# EAGLE design STorM32 Micro MotorTripple v02 micro (EAGLE 7.5.0)
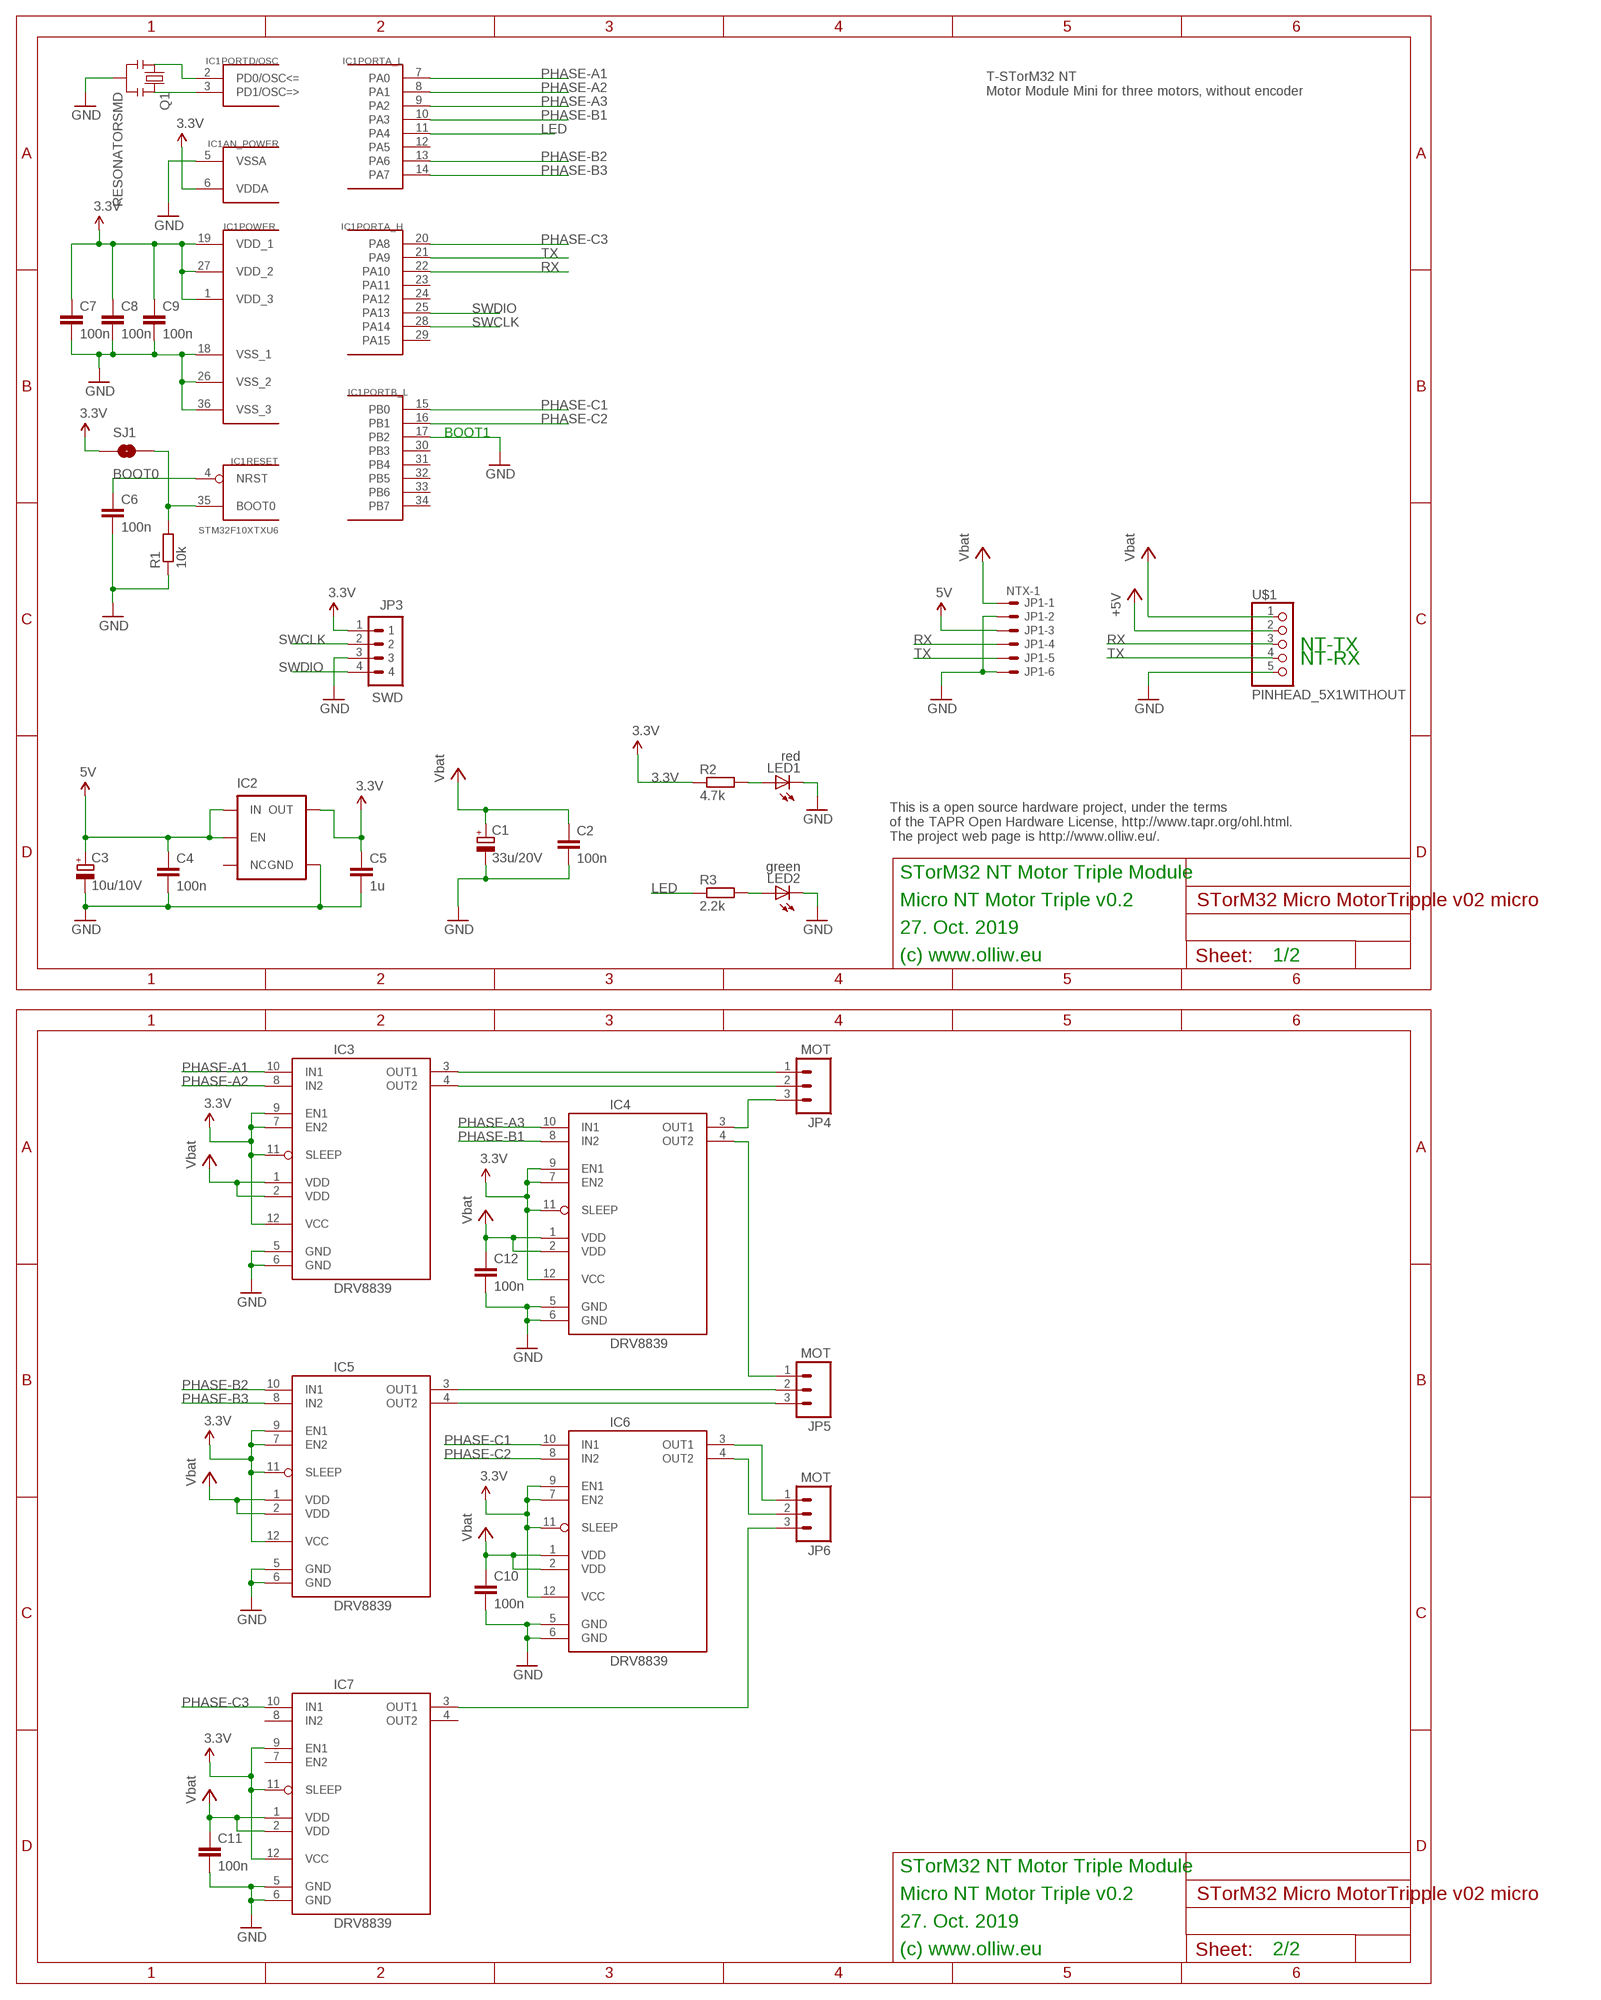
[diagram p0: schematic, sheet 1]

## Parts
C1  33u/20V  CPOL-EUSMCB  [SMC_B]
C2  100n  C-EUC0603  [C0603]
C3  10u/10V  CPOL-EUSMCA  [SMC_A]
C4  100n  C-EUC0402  [C0402]
C5  1u  C-EUC0603  [C0603]
C6  100n  C-EUC0402  [C0402]
C7  100n  C-EUC0402  [C0402]
C8  100n  C-EUC0402  [C0402]
C9  100n  C-EUC0402  [C0402]
C10  100n  C-EUC0603  [C0603]
C11  100n  C-EUC0603  [C0603]
C12  100n  C-EUC0603  [C0603]
IC1  STM32F10XTXU6  [VFQFPN36]
IC2  V_REG_TPS76433SOT23-5  [SOT23-5]
IC3  DRV8839  [WSON-12-2X3MM]
IC4  DRV8839  [WSON-12-2X3MM]
IC5  DRV8839  [WSON-12-2X3MM]
IC6  DRV8839  [WSON-12-2X3MM]
IC7  DRV8839  [WSON-12-2X3MM]
JP1  NTX-1  SM06B-SRSS-TB  [SM06B-SRSS-TB]
JP3  SWD  P4X1_1P27-OCT_BILEX  [4X1_1P27_OCT_BILEX]
JP4  MOT  M03PTH  [1X03]
JP5  MOT  M03PTH  [1X03]
JP6  MOT  M03PTH  [1X03]
LED1  red  LEDCHIPLED_0603  [CHIPLED_0603]
LED2  green  LEDCHIPLED_0603  [CHIPLED_0603]
Q1  RESONATORSMD  [RESONATOR-SMD]
R1  10k  R-EU_R0402  [R0402]
R2  4.7k  R-EU_R0402  [R0402]
R3  2.2k  R-EU_R0402  [R0402]
SJ1  BOOT0  SOLDERJUMPERNO  [SJ_2S-NO]
U$1  PINHEAD_5X1WITHOUT  [PINHEAD_5X1_WO]

## Nets
3.3V: C5.1 C7.1 C8.1 C9.1 IC1.1(POWER:VDD_3) IC1.6(AN_POWER:VDDA) IC1.19(POWER:VDD_1) IC1.27(POWER:VDD_2) IC2.5(OUT) IC3.7(EN2) IC3.9(EN1) IC3.11(SLEEP) IC3.12(VCC) IC4.7(EN2) IC4.9(EN1) IC4.11(SLEEP) IC4.12(VCC) IC5.7(EN2) IC5.9(EN1) IC5.11(SLEEP) IC5.12(VCC) IC6.7(EN2) IC6.9(EN1) IC6.11(SLEEP) IC6.12(VCC) IC7.9(EN1) IC7.11(SLEEP) IC7.12(VCC) JP3.1 R2.1 SJ1.1
5V: C3.+ C4.1 IC2.1(IN) IC2.3(EN) JP1.3 U$1.2 ; supply symbol labelled +5V
GND: C1.- C2.2 C3.- C4.2 C5.2 C6.2 C7.2 C8.2 C9.2 C10.2 C11.2 C12.2 IC1.5(AN_POWER:VSSA) IC1.17(PORTB_L:PB2) IC1.18(POWER:VSS_1) IC1.26(POWER:VSS_2) IC1.36(POWER:VSS_3) IC2.2(GND) IC3.5(GND) IC3.6(GND) IC4.5(GND) IC4.6(GND) IC5.5(GND) IC5.6(GND) IC6.5(GND) IC6.6(GND) IC7.5(GND) IC7.6(GND) JP1.2 JP1.6 JP3.3 LED1.C LED2.C Q1.2 R1.1 U$1.5
LED: IC1.11(PORTA_L:PA4) R3.1
N$6: IC4.3(OUT1) JP4.3
N$7: C6.1 IC1.4(RESET:NRST)
N$8: IC1.35(RESET:BOOT0) R1.2 SJ1.2
N$9: IC1.2(PORTD/OSC:PD0/OSC<=) Q1.1
N$10: IC1.3(PORTD/OSC:PD1/OSC=>) Q1.3
N$11: LED1.A R2.2
N$12: LED2.A R3.2
N$13: IC6.3(OUT1) JP6.1
N$14: IC3.4(OUT2) JP4.2
N$15: IC3.3(OUT1) JP4.1
N$17: IC5.3(OUT1) JP5.2
N$18: IC4.4(OUT2) JP5.1
N$19: IC5.4(OUT2) JP5.3
N$20: IC6.4(OUT2) JP6.2
N$21: IC7.3(OUT1) JP6.3
PHASE-A1: IC1.7(PORTA_L:PA0) IC3.10(IN1)
PHASE-A2: IC1.8(PORTA_L:PA1) IC3.8(IN2)
PHASE-A3: IC1.9(PORTA_L:PA2) IC4.10(IN1)
PHASE-B1: IC1.10(PORTA_L:PA3) IC4.8(IN2)
PHASE-B2: IC1.13(PORTA_L:PA6) IC5.10(IN1)
PHASE-B3: IC1.14(PORTA_L:PA7) IC5.8(IN2)
PHASE-C1: IC1.15(PORTB_L:PB0) IC6.10(IN1)
PHASE-C2: IC1.16(PORTB_L:PB1) IC6.8(IN2)
PHASE-C3: IC1.20(PORTA_H:PA8) IC7.10(IN1)
RX: IC1.22(PORTA_H:PA10) JP1.4 U$1.3
SWCLK: IC1.28(PORTA_H:PA14) JP3.2
SWDIO: IC1.25(PORTA_H:PA13) JP3.4
TX: IC1.21(PORTA_H:PA9) JP1.5 U$1.4
VCCG: C1.+ C2.1 C10.1 C11.1 C12.1 IC3.1(VDD) IC3.2(VDD) IC4.1(VDD) IC4.2(VDD) IC5.1(VDD) IC5.2(VDD) IC6.1(VDD) IC6.2(VDD) IC7.1(VDD) IC7.2(VDD) JP1.1 U$1.1 ; supply symbol labelled Vbat
Unconnected: IC1.12(PORTA_L:PA5) IC1.23(PORTA_H:PA11) IC1.24(PORTA_H:PA12) IC1.29(PORTA_H:PA15) IC1.30(PORTB_L:PB3) IC1.31(PORTB_L:PB4) IC1.32(PORTB_L:PB5) IC1.33(PORTB_L:PB6) IC1.34(PORTB_L:PB7) IC2.4(NC) IC7.4(OUT2) IC7.7(EN2) IC7.8(IN2)

## Notes on the sheet
- T-STorM32 NT
  Motor Module Mini for three motors, without encoder
- BOOT1
- NT-TX
- NT-RX
- This is a open source hardware project, under the terms
  of the TAPR Open Hardware License, http://www.tapr.org/ohl.html.
  The project web page is http://www.olliw.eu/.
- STorM32 NT Motor Triple Module
- Micro NT Motor Triple v0.2
- 27. Oct. 2019
- (c) www.olliw.eu | 1/2
- STorM32 NT Motor Triple Module
- Micro NT Motor Triple v0.2
- 27. Oct. 2019
- (c) www.olliw.eu | 2/2

## Library data of the parts
C1 C3 = rcl:CPOL-EU: POLARIZED CAPACITOR, European symbol
C2 C4-C12 = rcl:C-EU: CAPACITOR, European symbol
IC1 = # stm32:STM32F10XTXU6: STM32F101/103 36pad VFQPFN36
IC2 = # SparkFun2:V_REG_TPS76433: Voltage Regulator Older TI part. LDO 150mA regulator. No output by-pass cap option. See V_REG_LDO for a better part.
IC3-IC7 = # stdlib:DRV8839
JP1 = con-jst2:?M06B-SRSS-TB: Disconnectable Crimp style connector, 1.0mm pitch 6 contacts
JP3 = # stdlib:P4X1_1P27
JP4-JP6 = # SparkFun:M03: Header 3 Standard 3-pin 0.1" header. Use with straight break away headers (SKU : PRT-00116), right angle break away headers (PRT-00553), swiss pins (PRT-00743), machine pins (PRT-00117), and female headers (PRT-00115). Molex polarized connector foot print use with SKU : PRT-08232 with associated crimp pins and housings.
LED1 LED2 = led:LED: LED OSRAM: - CHIPLED LG R971, LG N971, LY N971, LG Q971, LY Q971, LO R971, LY R971 LH N974, LH R974 LS Q976, LO Q976, LY Q976 LO Q996 - Hyper CHIPLED LW Q18S LB Q993, LB Q99A, LB R99A - SideLED LS A670, LO A670, LY A670, LG A670, LP A670 LB A673, LV A673, LT A673, LW A673 LH A674 LY A675 LS A676, LA A676, LO A676, LY A676, LW A676 LS A679, LY A679, LG A679 - Hyper Micro SIDELED® LS Y876, LA Y876, LO Y876, LY Y876 LT Y87S - SmartLED LW L88C, LW L88S LB L89C, LB L89S, LG L890 LS L89K, LO L89K, LY L89K LS L896, LA L896, LO L896, LY L896 - TOPLED LS T670, LO T670, LY T670, LG T670, LP T670 LSG T670, LSP T670, LSY T670, LOP T670, LYG T670 LG T671, LOG T671, LSG T671 LB T673, LV T673, LT T673, LW T673 LH T674 LS T676, LA T676, LO T676, LY T676, LB T676, LH T676, LSB T676, LW T676 LB T67C, LV T67C, LT T67C, LS T67K, LO T67K, LY T67K, LW E67C LS E67B, LA E67B, LO E67B, LY E67B, LB E67C, LV E67C, LT E67C LW T67C LS T679, LY T679, LG T679 LS T770, LO T770, LY T770, LG T770, LP T770 LB T773, LV T773, LT T773, LW T773 LH T774 LS E675, LA E675, LY E675, LS T675 LS T776, LA T776, LO T776, LY T776, LB T776 LHGB T686 LT T68C, LB T68C - Hyper Mini TOPLED® LB M676 - Mini TOPLED Santana® LG M470 LS M47K, LO M47K, LY M47K Source: http://www.osram.convergy.de LUXEON: - LUMILED® LXK2-PW12-R00, LXK2-PW12-S00, LXK2-PW14-U00, LXK2-PW14-V00 LXK2-PM12-R00, LXK2-PM12-S00, LXK2-PM14-U00 LXK2-PE12-Q00, LXK2-PE12-R00, LXK2-PE12-S00, LXK2-PE14-T00, LXK2-PE14-U00 LXK2-PB12-K00, LXK2-PB12-L00, LXK2-PB12-M00, LXK2-PB14-N00, LXK2-PB14-P00, LXK2-PB14-Q00 LXK2-PR12-L00, LXK2-PR12-M00, LXK2-PR14-Q00, LXK2-PR14-R00 LXK2-PD12-Q00, LXK2-PD12-R00, LXK2-PD12-S00 LXK2-PH12-R00, LXK2-PH12-S00 LXK2-PL12-P00, LXK2-PL12-Q00, LXK2-PL12-R00 Source: www.luxeon.com KINGBRIGHT: KA-3528ASYC Source: www.kingbright.com
Q1 = # SparkFun2:RESONATOR: Resonator Small SMD resonator. This is the itty bitty 10/20MHz resonators with built in caps. CSTCE10M0G55 and CSTCE20M0V53. Footprint has been reviewed closely but hasn't been tested yet.
R1-R3 = rcl:R-EU_: RESISTOR, European symbol
SJ1 = # SparkFun2:SOLDERJUMPER: Solder Jumper Standard SMD solder jumper. Used to automate production. Two varients : Normally Open and Normally Closed are the same, but have different paste layers. NC will have a large amount of paste and should jumper during reflow.
U$1 = # stdlib:PINHEAD_5X1

## Board
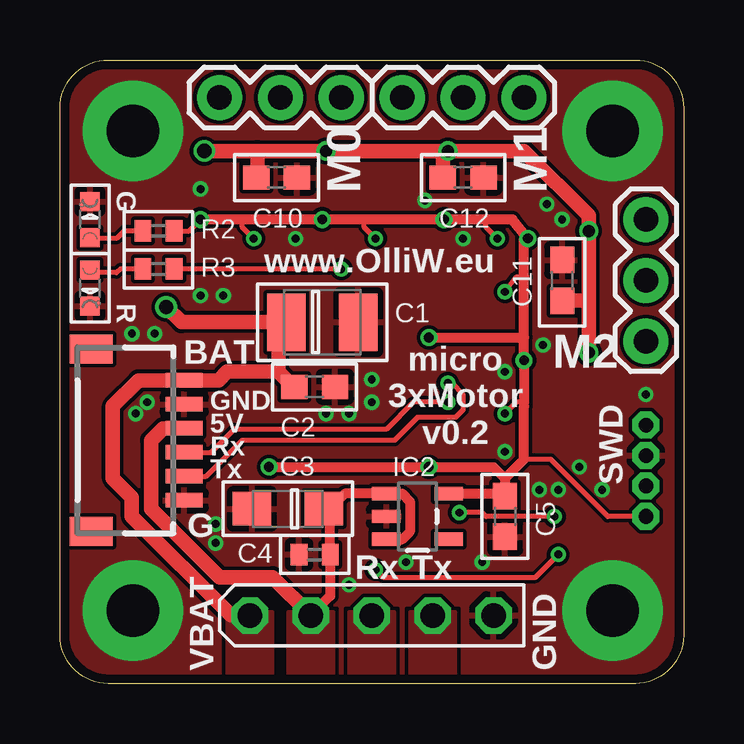
[diagram p1: board, top side]
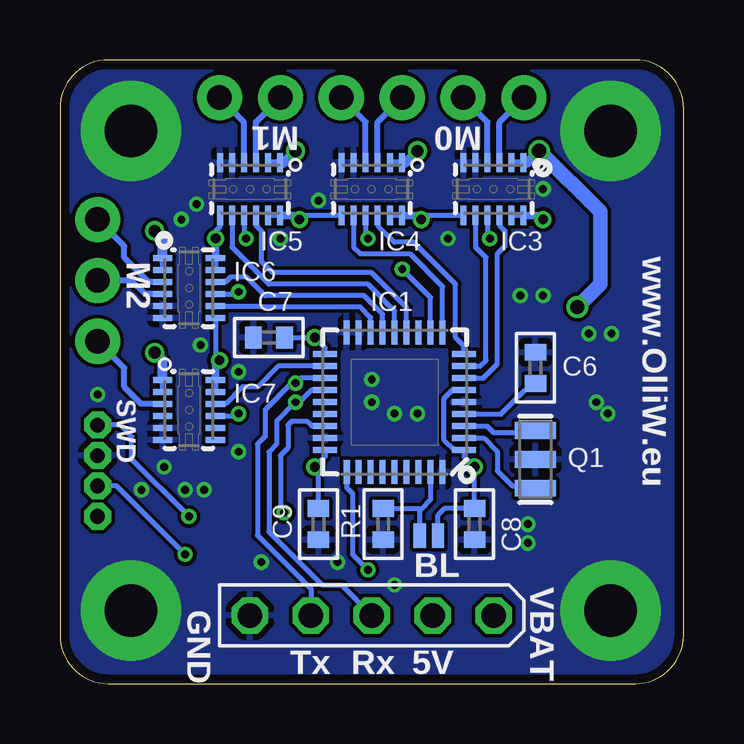
[diagram p2: board, bottom side, seen from below]

Size 26 x 26 mm. Coordinates in mm from the lower left corner, seen from the top.
Outline: 24,0 2,0 arc-90 0,2 0,24 arc-90 2,26 24,26 arc-90 26,24 26,2 arc-90 24,0
Copper layers (1*16): Top 0.035mm / dielectric 1.5mm / Bottom 0.035mm
Design rules "ShenZhen2U_2layer_EagleRules *": minimum track width 6mil, minimum drill 12mil, track to track 6mil, track to pad 6mil, pad to pad 6mil, via to via 6mil, smd to smd 0mil, copper to edge 15mil, drill to drill 10mil, minimum pad ring 10mil, minimum via ring 6mil, stop-mask expansion 2mil, vias tented up to drill 25mil, thermal gap 10mil

### Footprints (pad centres in the part's own frame; a part is rotated, then mirrored left to right if it is on the bottom)
SMC_B = smd 1.6 x 2.4: + -1.5,0; - 1.5,0
C0603 = smd 1.1 x 1: 1 -0.85,0; 2 0.85,0
SMC_A = smd 1.6 x 1.4: + -1.5,0; - 1.5,0
C0402 = smd 0.7 x 0.9: 1 -0.65,0; 2 0.65,0
VFQFPN36 = smd 1 x 0.25: 1 -2.9,2; 2 -2.9,1.5; 3 -2.9,1; 4 -2.9,0.5; 5 -2.9,0; 6 -2.9,-0.5; 7 -2.9,-1; 8 -2.9,-1.5; 9 -2.9,-2; 19 2.9,-2; 20 2.9,-1.5; 21 2.9,-1; 22 2.9,-0.5; 23 2.9,0; 24 2.9,0.5; 25 2.9,1; 26 2.9,1.5; 27 2.9,2 | smd 0.25 x 1: 10 -2,-2.9; 11 -1.5,-2.9; 12 -1,-2.9; 13 -0.5,-2.9; 14 0,-2.9; 15 0.5,-2.9; 16 1,-2.9; 17 1.5,-2.9; 18 2,-2.9; 29 1.5,2.9; 30 1,2.9; 31 0.5,2.9; 32 0,2.9; 33 -0.5,2.9; 34 -1,2.9; 35 -1.5,2.9; 36 -2,2.9 | smd 0.27 x 1: 28 2,2.9
SOT23-5 = smd 0.55 x 1.2: 1 -0.95,-1.3; 2 0,-1.3; 3 0.95,-1.3; 4 0.95,1.3; 5 -0.95,1.3
WSON-12-2X3MM = smd 0.8 x 0.25: 1 -1.1,1.25; 2 -1.1,0.75; 3 -1.1,0.25; 4 -1.1,-0.25; 5 -1.1,-0.75; 6 -1.1,-1.25; 7 1.1,-1.25; 8 1.1,-0.75; 9 1.1,-0.25; 10 1.1,0.25; 11 1.1,0.75; 12 1.1,1.25
SM06B-SRSS-TB = smd 0.6 x 1.55: 1 -2.5,2.975; 2 -1.5,2.975; 3 -0.5,2.975; 4 0.5,2.975; 5 1.5,2.975; 6 2.5,2.975 | smd 1.2 x 1.8: FIT@1 -3.8,-0.9; FIT@2 3.8,-0.9
4X1_1P27_OCT_BILEX = drill 0.61 pad 1.118 octagon: 1 0,0; 2 0,-1.27; 3 0,-2.54; 4 0,-3.81
1X03 = drill 1.016 pad 1.88: 1 0,0; 2 2.54,0; 3 5.08,0
CHIPLED_0603 = smd 0.8 x 0.8: A 0,-0.75; C 0,0.75
RESONATOR-SMD = smd 0.7 x 1.7: 1 -1.2,0; 2 0,0; 3 1.2,0
R0402 = smd 0.7 x 0.9: 1 -0.65,0; 2 0.65,0
SJ_2S-NO = smd 0.508 x 1.016: 1 -0.381,0; 2 0.381,0
PINHEAD_5X1_WO = drill 1.016 octagon: 1 0,0; 2 0,-2.54; 3 0,-5.08; 4 0,-7.62; 5 0,-10.16

### Placement (x,y rotation side)
C1  10.94,15.06 0 top
C2  10.62,12.37 0 top
C3  9.51,7.29 180 top
C4  10.62,5.38 180 top
C5  18.56,6.97 270 top
C6  6.17,13.16 90 bottom
C7  17.29,14.43 180 bottom
C8  8.71,6.65 270 bottom
C9  15.22,6.65 270 bottom
C10  9.03,21.1 0 top
C11  20.94,16.81 90 top
C12  16.81,21.1 0 top
IC1  12.05,11.73 180 bottom
IC2  14.9,6.97 270 top
IC3  7.92,20.62 270 bottom
IC4  13,20.62 270 bottom
IC5  18.08,20.62 270 bottom
IC6  20.62,16.49 0 bottom
IC7  20.62,11.41 0 bottom
JP1  2.21,10.14 270 top
JP3  24.43,6.97 180 top
JP4  6.65,24.43 0 top
JP5  14.27,24.43 0 top
JP6  24.43,19.35 270 top
LED1  1.25,19.35 0 top
LED2  1.25,16.49 180 top
Q1  6.17,9.35 90 bottom
R1  12.52,6.65 90 bottom
R2  4.11,18.87 180 top
R3  4.11,17.29 180 top
SJ1  10.62,6.17 180 bottom
U$1  7.92,2.84 270 bottom

### Tracks (layer width: path | path; a pad name or v marks a point on that pad's centre or on a via)
3.3V  (via drill 0.33, 0.4)
  Top 0.203: v8.08,18.56 7.6,19.03 7.6,19.35 | v13.16,18.56 12.68,19.03 12.68,19.35 | v18.24,18.56 17.76,19.03 17.76,19.35 | v18.56,16.33 19.03,16.97 19.35,16.97 | v18.56,11.25 19.03,11.73 19.19,11.73 | 19.35,11.73 19.19,11.73 | 19.35,11.57 19.19,11.73 | JP3.1 22.84,6.97 20.46,9.35 19.35,9.35 | R2.1 5.38,18.87 v5.86,19.35
  Top 0.406: v5.86,19.35 7.6,19.35 v10.94,19.35 12.68,19.35 v16.02,19.35 17.76,19.35 18.87,19.35 v19.51,18.56 19.35,18.56 19.35,16.97 19.35,14.43 | 19.35,14.43 v19.35,13.48 19.35,11.73 | v8.71,9.03 v15.38,9.03 18.08,9.03 18.56,8.55 | IC2.5 18.46,7.92 C5.1 18.56,8.55 | v15.38,14.43 19.35,14.43 | 18.56,8.55 19.35,9.35 19.35,11.57
  Bottom 0.203: IC3.12 IC3.11 | IC4.12 IC4.11 | IC5.12 IC5.11 | IC6.12 IC6.11 | IC7.12 IC7.11 | IC3.7 10.77,19.52 v10.94,19.35 | IC3.9 8.17,18.62 v8.08,18.56 | IC4.9 13.25,18.62 v13.16,18.56 | IC5.9 18.33,18.65 v18.24,18.56 | IC4.7 15.85,19.52 v16.02,19.35 | 19.52,18.55 v19.51,18.56 19.51,18.87 19.33,19.05 IC5.7 | IC6.9 18.65,16.24 v18.56,16.33 | IC6.7 19.52,13.65 v19.35,13.48 | IC7.9 18.65,11.16 v18.56,11.25 | v15.38,9.03 15.22,9.19 | IC1.27 14.95,9.46 v15.38,9.03 | IC1.19 14.95,13.99 v15.38,14.43 C7.1 | C9.1 15.22,8.87 v15.38,9.03 | IC1.6 9.64,12.23 9.98,11.89 9.98,10.14 9.57,9.73 IC1.1 9.15,9.46 v8.71,9.03 C8.1 9.97,7.3 10.24,7.03 SJ1.1
  Bottom 0.305: IC3.12 6.03,19.52 v5.86,19.35 | IC4.12 11.11,19.52 v10.94,19.35 | IC5.12 16.19,19.52 v16.02,19.35 | IC6.12 19.52,18.55 | IC7.12 19.52,13.31 v19.35,13.48
5V
  Top 0.406: IC2.3 14.27,6.02 14.59,6.33 14.59,7.6 14.27,7.92 IC2.1 11.89,7.92 11.25,7.29 C3.+ 11.27,7.02 C4.1 11.27,3.65 U$1.2
  Top 0.61: JP1.3 4.29,10.64 3.79,10.14 3.79,7.29 6.65,4.43 8.87,4.43 U$1.2
  pour Top (isolate 0.305, no thermals): 9.51,0.14 9.51,3 11.41,3 11.41,0.14
GND  (via drill 0.33, 2.2 pad 4.2)
  other vias: 3.04,3.04 23.04,3.04 3.04,23.04 23.04,23.04 6.49,6.65 3.63,11.73 9.82,18.56 16.81,18.56 5.86,20.62 20.78,8.08 22.6,8.08 24.43,12.05 13,11.73 12.05,11.25 13,12.68 11.1,11.25 18.56,13 14.43,5.06 17.6,5.06 12.05,4.11 6.49,5.86 19.98,8.08 18.56,9.67 3.16,11.25 5.86,16.17 6.81,16.17 20.3,19.98 20.94,19.35 3,14.59 3.95,14.59 20.14,14.11 15.22,20.14 21.65,9.03
  pour Top (isolate 0.152, rank 6): -0.97,-0.97 -0.97,26.97 26.97,26.97 26.97,-0.97
  pour Bottom (isolate 0.152, rank 6): -0.34,-0.34 -0.34,26.34 26.34,26.34 26.34,-0.34
LED  (via drill 0.33)
  Top 0.203: v11.73,17.29 R3.1
  Bottom 0.203: IC1.11 10.55,16.1 v11.73,17.29
N$6
  Bottom 0.254: IC4.3 12.75,23.41 JP4.3
N$7
  Bottom 0.203: IC1.4 7.61,11.23 6.65,12.19 C6.1
N$8
  Bottom 0.203: IC1.35 10.55,7.67 10.94,7.29 | 10.94,7.29 12.35,7.29 R1.2 | SJ1.2 11,7.22 10.94,7.29
N$9
  Bottom 0.203: IC1.2 8.32,10.23 7.76,9.67 7.76,8.87 7.13,8.24 6.26,8.24 Q1.1
N$10
  Bottom 0.203: IC1.3 8.19,10.73 7.92,10.46 6.42,10.46 Q1.3
N$11
  Top 0.203: R2.2 2.68,18.87 2.36,18.56 1.45,18.56 LED1.A
N$12
  Top 0.203: R3.2 2.52,17.29 2.36,17.13 1.45,17.13 LED2.A
N$13
  Bottom 0.254: IC6.3 22.3,16.74 23.32,17.76 23.32,18.24 JP6.1
N$14
  Bottom 0.254: IC3.4 8.17,23.41 JP4.2
N$15
  Bottom 0.254: IC3.3 7.67,23.41 JP4.1
N$17
  Bottom 0.254: IC5.3 17.83,23.41 JP5.2
N$18
  Bottom 0.254: IC4.4 13.25,23.41 JP5.1
N$19
  Bottom 0.254: IC5.4 18.33,23.41 JP5.3
N$20
  Bottom 0.254: IC6.4 22.43,16.24 23,16.81 JP6.2
N$21
  Bottom 0.254: IC7.3 22.62,11.66 23.32,12.37 23.32,13.16 JP6.3
PHASE-A1
  Bottom 0.203: IC1.7 8.35,12.73 7.76,13.32 7.76,17.92 7.44,18.24 7.44,18.87 7.67,19.1 IC3.10
PHASE-A2
  Bottom 0.203: IC1.8 8.48,13.23 8.24,13.48 8.24,17.76 8.67,18.2 IC3.8
PHASE-A3
  Bottom 0.203: IC1.9 9.15,14.07 9.51,14.43 9.51,16.65 11.25,18.4 12.05,18.4 12.75,19.1 IC4.10
PHASE-B1
  Bottom 0.203: IC1.10 10.05,16.56 11.41,17.92 13.48,17.92 13.75,18.2 IC4.8
PHASE-B2
  Bottom 0.203: IC1.13 11.55,15.67 13,17.13 17.13,17.13 17.6,17.6 17.6,18.87 17.83,19.1 IC5.10
PHASE-B3
  Bottom 0.203: IC1.14 12.05,15.54 13.16,16.65 17.29,16.65 18.83,18.2 IC5.8
PHASE-C1
  Bottom 0.203: IC1.15 12.55,15.4 13.32,16.17 17.45,16.17 18.24,16.97 18.87,16.97 19.1,16.74 IC6.10
PHASE-C2
  Bottom 0.203: IC1.16 13.05,15.27 13.48,15.7 17.6,15.7 17.65,15.74 IC6.8
PHASE-C3
  Bottom 0.203: IC1.20 16.9,13.23 17.76,12.37 18.4,12.37 19.1,11.66 IC7.10
RX  (via drill 0.33)
  Top 0.203: JP1.4 6.31,9.64 7.29,10.62 13.63,10.62 14.75,11.73 v16.17,11.73
  Bottom 0.203: U$1.3 14.27,4.11 15.06,4.11 17.29,6.33 17.29,9.67 16.97,9.98 16.97,10.94 v16.17,11.73 16.02,11.73 15.52,12.23 IC1.22
  pour Top (isolate 0.305, no thermals): 12.05,0.14 12.05,3 13.95,3 13.95,0.14
SWCLK  (via drill 0.33)
  Top 0.203: v13.16,4.75 13.48,4.43 19.83,4.43 v20.78,5.38
  Bottom 0.203: IC1.28 14.05,8.17 13.79,7.92 13.79,5.38 v13.16,4.75 | v20.78,5.38 23.64,8.24 JP3.2
SWDIO  (via drill 0.33)
  Top 0.203: v20.62,6.97 17.76,6.97 17.6,7.13 v16.65,7.13
  Bottom 0.203: IC1.25 15.49,10.73 15.7,10.94 16.33,10.94 16.49,10.78 16.49,9.82 16.81,9.51 16.81,7.29 v16.65,7.13 | v20.62,6.97 23,9.35 23,10.3 23.48,10.78 JP3.4
TX  (via drill 0.33)
  Top 0.203: v16.17,12.52 16.33,12.52 16.81,12.05 16.81,11.41 16.49,11.1 14.9,11.1 13.95,10.14 7.6,10.14 6.1,8.64 JP1.5
  Bottom 0.203: U$1.4 15.54,3.95 17.76,6.17 17.76,9.98 17.45,10.3 17.45,11.41 16.33,12.52 v16.17,12.52 15.97,12.73 IC1.21
  pour Top (isolate 0.305, no thermals): 14.59,0.14 14.59,3 16.49,3 16.49,0.14
VCCG  (via drill 0.5, 0.6)
  Top 0.203: C10.1 8.24,21.1
  Top 0.61: v6.02,22.21 8.24,22.21 | 8.24,22.21 v11.1,22.21 v16.17,22.21 | v16.17,22.21 19.35,22.21 22.05,19.51 v22.05,18.87 22.05,15.86 | v22.05,13.79 22.05,15.86 | C12.1 15.96,21.99 v16.17,22.21 | 22.05,15.86 21.95,15.96 C11.1 | C1.+ 9.19,15.06 | 9.12,13 9.12,12.98 C2.1 | U$1.1 7.13,2.84 3,6.97 3,7.76 2.21,8.55 2.21,11.57 3.28,12.64 JP1.1 6.61,12.64 6.97,13 9.12,13 | C1.+ 5.06,15.06 v4.43,15.7 | 8.24,21.1 8.24,22.21 | 9.12,13 9.12,14.75 C1.+
  Bottom 0.254: IC3.1 IC3.2 | IC4.1 IC4.2 | IC5.1 IC5.2 | IC6.1 IC6.2 | IC7.1 IC7.2
  Bottom 0.406: IC3.1 6.5,21.72 v6.02,22.21 | IC4.1 11.58,21.72 v11.1,22.21 | IC5.1 16.66,21.72 v16.17,22.21 | IC6.1 21.72,18.57 v22.05,18.87 | IC7.1 21.72,13.49 v22.05,13.79
  Bottom 0.61: v4.43,15.7 3.47,16.65 3.47,19.67 v6.02,22.21
  pour Top (isolate 0.305, no thermals): 6.97,0.14 6.97,3 8.87,3 8.87,0.14

### Text on the board
tNames: G | M0 | M1 | www.OlliW.eu | R | BAT | M2 | GND | SWD | 5V | Rx | micro / 3xMotor / v0.2 | Tx | G | Rx | Tx | VBAT | GND
bNames: M0 | M1 | M2 | www.OlliW.eu | SWD | BL | VBAT | GND | 5V | Rx | Tx